# EAGLE design dummy load_moved (EAGLE 6.1)
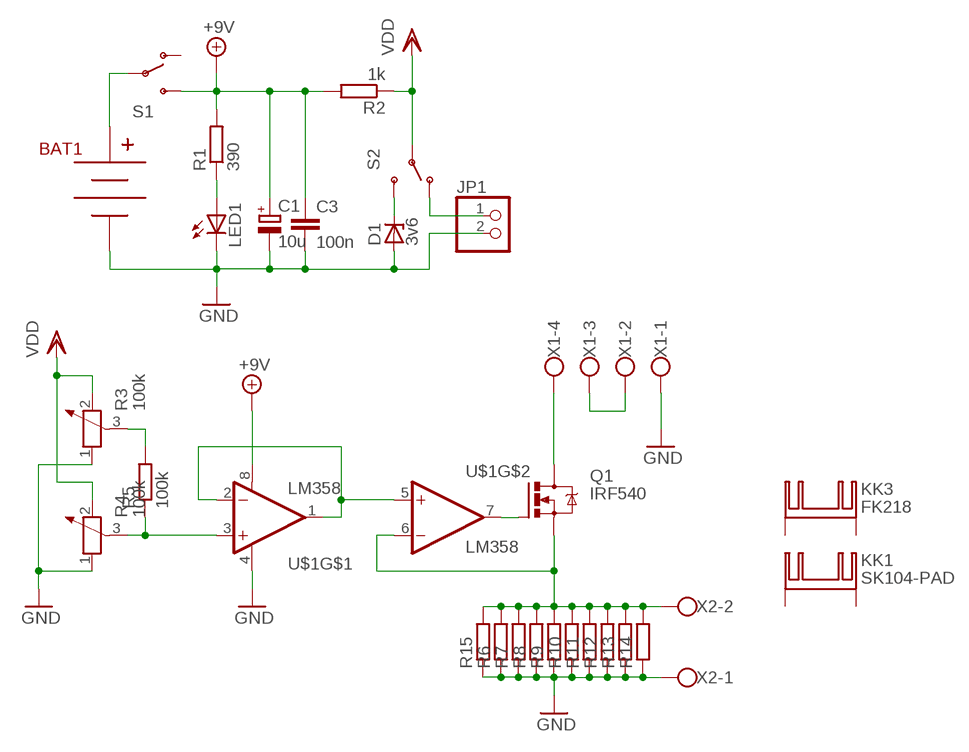
[diagram p0: schematic, sheet 1]

## Parts
BAT1  BC9VPC  [BC9VPC]
C1  10u  CPOL-EUTT2D5L  [TT2D5L]
C3  100n  C-EU025-025X050  [C025-025X050]
D1  3v6  ZENER-DIODEZD-5  [ZDIO-5]
JP1  PINHD-1X2  [1X02]
KK1  SK104-PAD  [SK104-PAD]
KK3  FK218  [FK218]
LED1  LED5MM  [LED5MM]
Q1  IRF540  [TO220BV]
R1  390  R-EU_0204/7  [0204/7]
R2  1k  R-EU_0204/7  [0204/7]
R3  100k  POTENTIOMETER_PT-10  [PT-10]
R4  100k  POTENTIOMETER_PT-10  [PT-10]
R5  100k  R-EU_0204/7  [0204/7]
R6  R-EU_0207/7  [0207/7]
R7  R-EU_0207/7  [0207/7]
R8  R-EU_0207/7  [0207/7]
R9  R-EU_0207/7  [0207/7]
R10  R-EU_0207/7  [0207/7]
R11  R-EU_0207/7  [0207/7]
R12  R-EU_0207/7  [0207/7]
R13  R-EU_0207/7  [0207/7]
R14  R-EU_0207/7  [0207/7]
R15  R-EU_0207/7  [0207/7]
S1  SWITCH-SPSTPTH  [SWITCH-SPDT]
S2  SWITCH-SPSTPTH  [SWITCH-SPDT]
U$1  LM358  [DIP08]
X1  W237-4  [W237-4]
X2  W237-102  [W237-102]

## Nets
+9V: C1.+ C3.1 R1.2 R2.2 S1.3(S) U$1.8(V+)
GND: BAT1.V- C1.- C3.2 D1.A JP1.2 LED1.K(C) R3.1 R4.1 R6.1 R7.1 R8.1 R9.1 R10.1 R11.1 R12.1 R13.1 R14.1 R15.1 U$1.4(V-) X1.1 X2.1
N$1: U$1.1(OUT) U$1.2(-IN) U$1.5(+IN)
N$2: R4.3 R5.1 U$1.3(+IN)
N$3: LED1.A R1.1
N$4: R3.3 R5.2
N$5: BAT1.V+ S1.2(P)
N$6: Q1.D X1.4
N$7: X1.2 X1.3
N$9: Q1.G U$1.7(OUT)
N$10: D1.C S2.3(S)
N$11: JP1.1 S2.1(O)
N$16: Q1.S R6.2 R7.2 R8.2 R9.2 R10.2 R11.2 R12.2 R13.2 R14.2 R15.2 U$1.6(-IN) X2.2
VDD: R2.1 R3.2 R4.2 S2.2(P)
Unconnected: KK1.K1(K) KK1.K2(K) KK3.A2,2(K) KK3.B2,2(K) S1.1(O)

## Library data of the parts
BAT1 = SparkFun-Connectors:BC9VPC: 9V board-mount battery cradle
C1 = rcl:CPOL-EU: POLARIZED CAPACITOR, European symbol
C3 = rcl:C-EU: CAPACITOR, European symbol
D1 = diode:ZENER-DIODE: Z-Diode
JP1 = pinhead:PINHD-1X2: PIN HEADER
KK1 = heatsink:SK104-PAD: HEATSINK manufacturer Fischer/distributor Buerklin
KK3 = heatsink:FK218: HEATSINK manufacturer Fischer/distributor Buerklin
LED1 = adafruit:LED: LED OSRAM: - CHIPLED LG R971, LG N971, LY N971, LG Q971, LY Q971, LO R971, LY R971 LH N974, LH R974 LS Q976, LO Q976, LY Q976 LO Q996 - Hyper CHIPLED LW Q18S LB Q993, LB Q99A, LB R99A - SideLED LS A670, LO A670, LY A670, LG A670, LP A670 LB A673, LV A673, LT A673, LW A673 LH A674 LY A675 LS A676, LA A676, LO A676, LY A676, LW A676 LS A679, LY A679, LG A679 - Hyper Micro SIDELED® LS Y876, LA Y876, LO Y876, LY Y876 LT Y87S - SmartLED LW L88C, LW L88S LB L89C, LB L89S, LG L890 LS L89K, LO L89K, LY L89K LS L896, LA L896, LO L896, LY L896 - TOPLED LS T670, LO T670, LY T670, LG T670, LP T670 LSG T670, LSP T670, LSY T670, LOP T670, LYG T670 LG T671, LOG T671, LSG T671 LB T673, LV T673, LT T673, LW T673 LH T674 LS T676, LA T676, LO T676, LY T676, LB T676, LH T676, LSB T676, LW T676 LB T67C, LV T67C, LT T67C, LS T67K, LO T67K, LY T67K, LW E67C LS E67B, LA E67B, LO E67B, LY E67B, LB E67C, LV E67C, LT E67C LW T67C LS T679, LY T679, LG T679 LS T770, LO T770, LY T770, LG T770, LP T770 LB T773, LV T773, LT T773, LW T773 LH T774 LS E675, LA E675, LY E675, LS T675 LS T776, LA T776, LO T776, LY T776, LB T776 LHGB T686 LT T68C, LB T68C - Hyper Mini TOPLED® LB M676 - Mini TOPLED Santana® LG M470 LS M47K, LO M47K, LY M47K Source: http://www.osram.convergy.de/
Q1 = transistor-power:IRF540: HEXFET Power MOSFET
R1 R2 R5-R15 = rcl:R-EU_: RESISTOR, European symbol
R3 R4 = rcl:POTENTIOMETER_: Potentiometer
S1 S2 = SparkFun:SWITCH-SPST: SPST Switch Simple slide switch. Spark Fun Electronics SKU : COM-00102
U$1 = SparkFun:LM358
X1 = con-wago-500:W237-4: WAGO SCREW CLAMP; OC_FARNELL: unknown; OC_NEWARK: unknown
X2 = con-wago-500:W237-102: WAGO SCREW CLAMP; MPN: 237-102; OC_FARNELL: unknown; OC_NEWARK: 70K9898

## Board
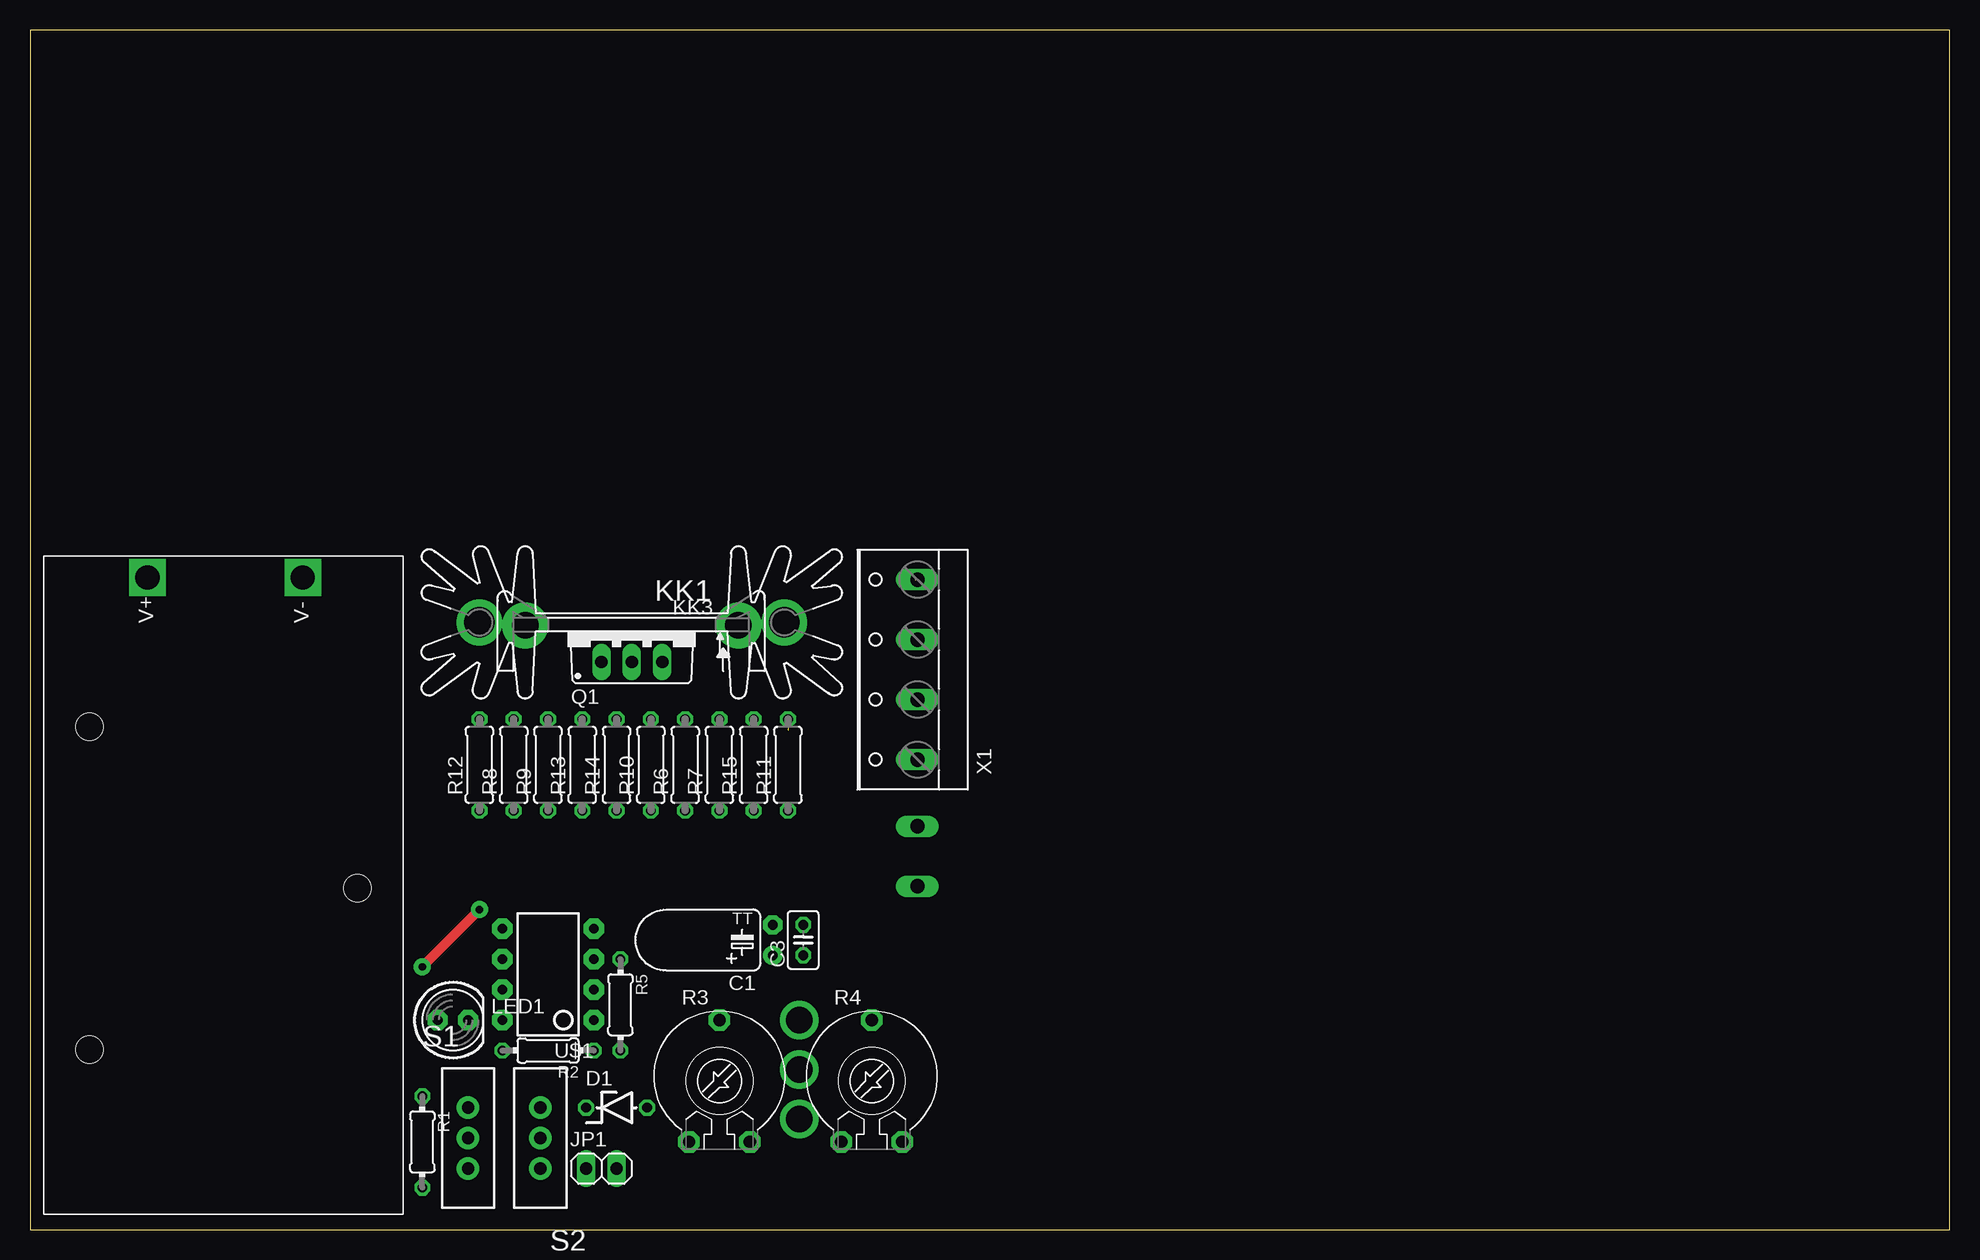
[diagram p1: board, top side]
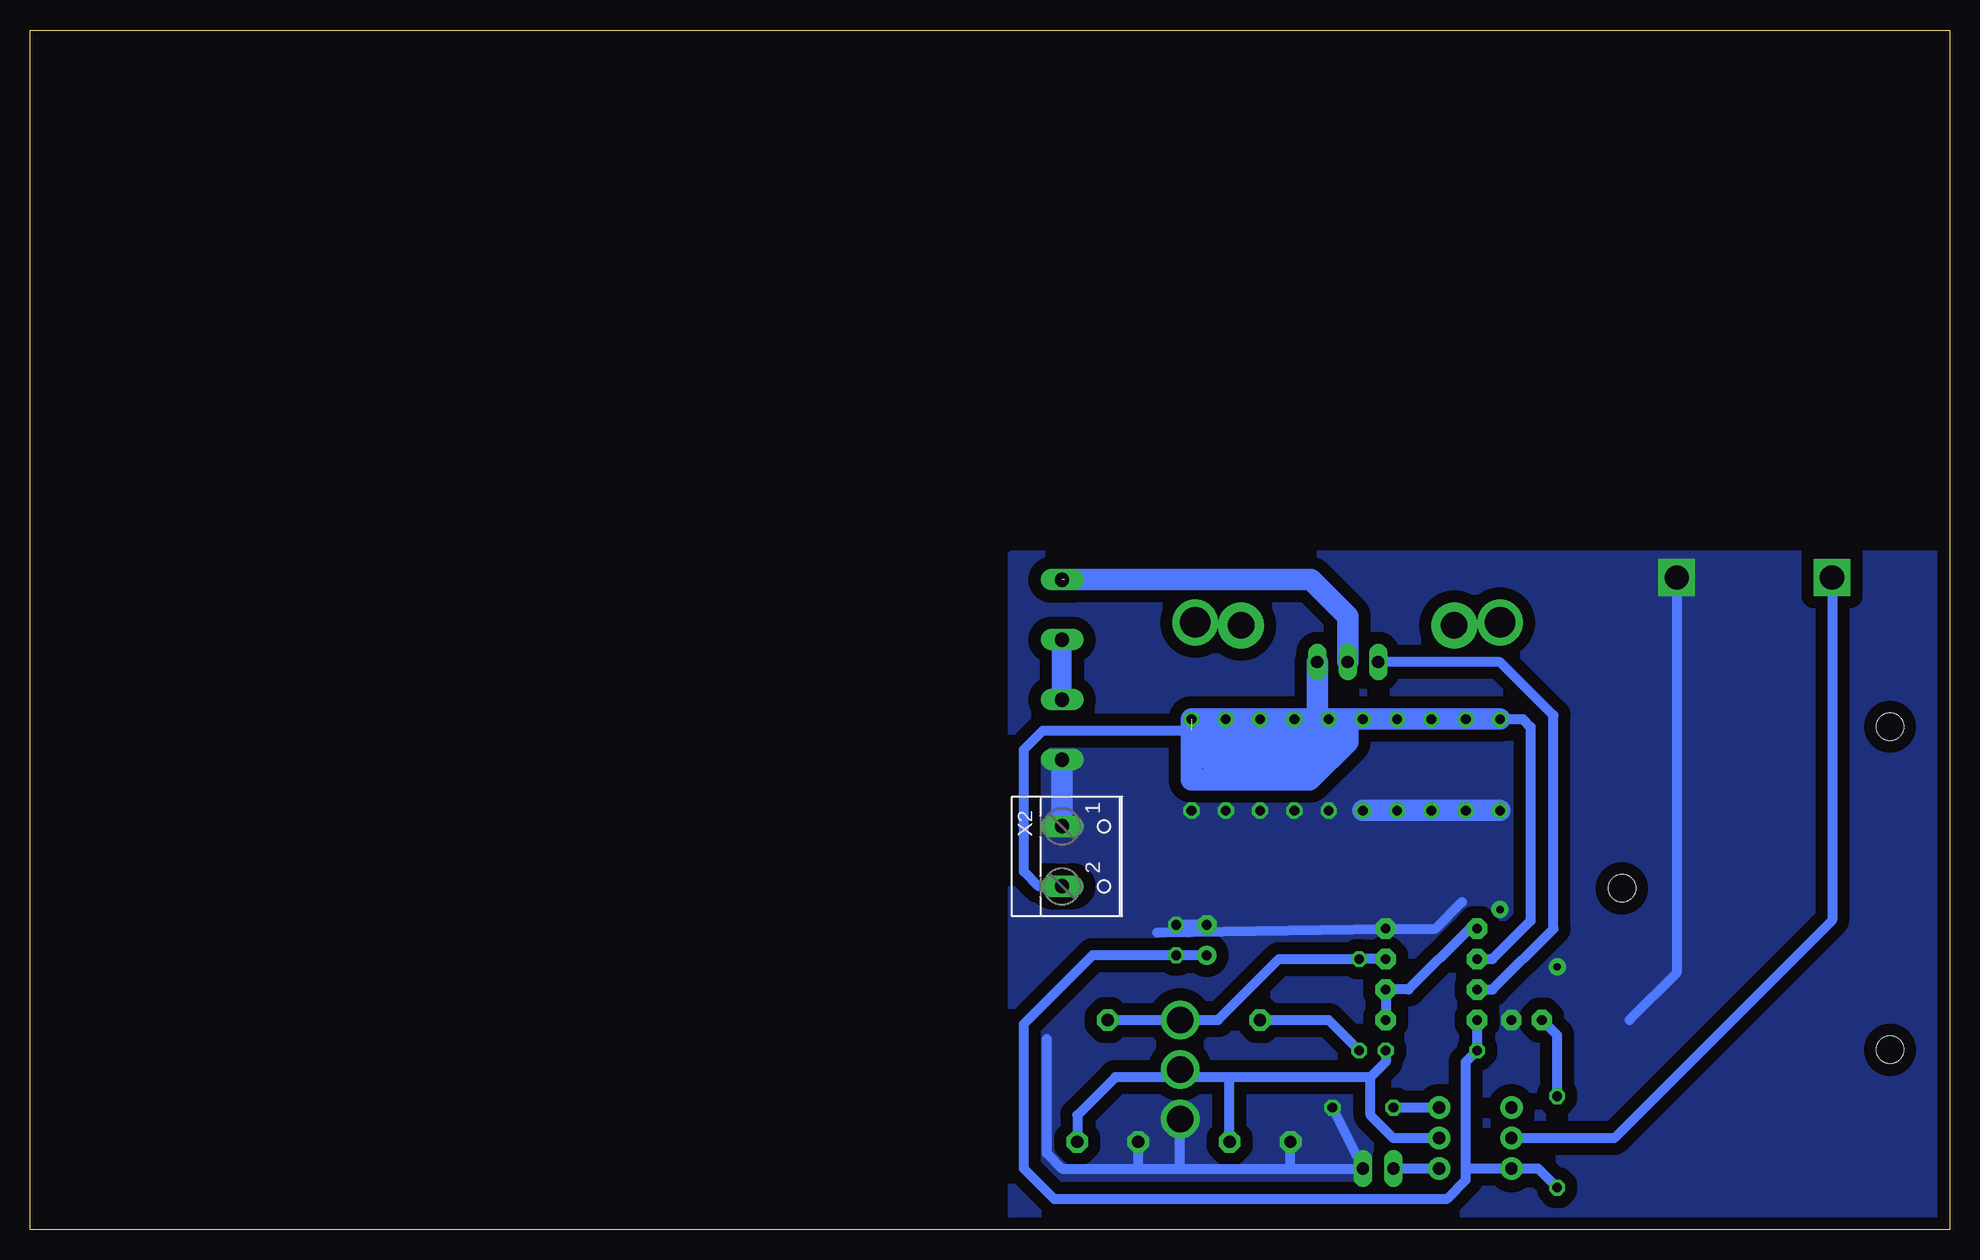
[diagram p2: board, bottom side, seen from below]

Size 160 x 100 mm. Coordinates in mm from the lower left corner, seen from the top.
Outline: 0,0 160,0 160,100 0,100 0,0
Copper layers (1*16): Top 0.035mm / dielectric 1.5mm / Bottom 0.035mm
Design rules: minimum track width 10mil, minimum drill 24mil, track to track 8mil, track to pad 8mil, pad to pad 8mil, via to via 8mil, smd to smd 8mil, copper to edge 40mil, drill to drill 8mil, minimum pad ring 10mil, minimum via ring 8mil, stop-mask expansion 4mil, vias tented up to drill 0mil, thermal gap 10mil

### Footprints (pad centres in the part's own frame; a part is rotated, then mirrored left to right if it is on the bottom)
BC9VPC = drill 2.032 square: V+ 53.086,21.336; V- 53.086,8.382 | hole 2.286: 27.178,3.81; 13.716,26.162; 40.64,26.162
TT2D5L = drill 0.813 pad 1.6: + -1.27,0 | drill 0.813 pad 1.6 octagon: - 1.27,0
C025-025X050 = drill 0.813 octagon: 1 -1.27,0; 2 1.27,0
ZDIO-5 = drill 0.813 octagon: A 2.54,0; C -2.54,0
1X02 = drill 1.016 long: 1 -1.27,0; 2 1.27,0
SK104-PAD = drill 2.54 pad 3.81: K1 -12.7,-0.762; K2 12.7,-0.762
FK218 = drill 2.21 pad 3.81: A2,2 -8.89,-0.508; B2,2 8.89,-0.508
LED5MM = drill 0.813 pad 1.676 octagon: A -1.27,0; K 1.27,0
TO220BV = drill 1.016 long: D 0,-2.54; G -2.54,-2.54; S 2.54,-2.54
0204/7 = drill 0.813 octagon: 1 -3.81,0; 2 3.81,0
PT-10 = drill 1.016 pad 1.778 octagon: 1 -2.54,-5.08; 2 2.54,-5.08; 3 0,5.08
0207/7 = drill 0.813 octagon: 1 -3.81,0; 2 3.81,0
SWITCH-SPDT = drill 1.016 pad 1.88: 1 0,2.54; 2 0,0; 3 0,-2.54
DIP08 = drill 0.813 pad 1.727 octagon: 1 -3.81,-3.81; 2 -1.27,-3.81; 3 1.27,-3.81; 4 3.81,-3.81; 5 3.81,3.81; 6 1.27,3.81; 7 -1.27,3.81; 8 -3.81,3.81
W237-4 = drill 1.194 long: 1 -7.5,-1.27; 2 -2.5,-1.27; 3 2.5,-1.27; 4 7.5,-1.27
W237-102 = drill 1.194 long: 1 -2.5,-1.27; 2 2.5,-1.27

### Placement (x,y rotation side)
BAT1  31.11,1.27 90 top
C1  61.91,24.13 90 top
C3  64.45,24.13 90 top
D1  48.9,10.16 0 top
JP1  47.62,5.08 0 top
KK1  50.16,49.85 180 top
KK3  50.16,49.85 180 top
LED1  35.24,17.46 0 top
Q1  50.16,49.85 0 top
R1  32.7,7.3 270 top
R2  43.18,14.92 180 top
R3  57.47,12.38 0 top
R4  70.17,12.38 0 top
R5  49.21,18.73 270 top
R6  54.61,38.73 90 top
R7  57.47,38.73 90 top
R8  40.32,38.73 90 top
R9  43.18,38.73 90 top
R10  51.75,38.73 90 top
R11  63.18,38.73 90 top
R12  37.47,38.73 90 top
R13  46.04,38.73 90 top
R14  48.9,38.73 90 top
R15  60.33,38.73 90 top
S1  36.51,7.62 0 top
S2  42.55,7.62 180 top
U$1  43.18,21.27 90 top
X1  72.71,46.67 90 top
X2  72.71,31.11 270 bottom

### Tracks (layer width: path | path; a pad name or v marks a point on that pad's centre or on a via)
+9V
  Bottom 0.813: 40.32,5.08 S1.3 34.29,5.08 R1.2 | 40.32,5.08 40.32,4.13 41.91,2.54 74.61,2.54 77.15,5.08 77.15,17.14 71.44,22.86 C1.+ C3.1 | U$1.8 R2.2 40.32,13.97 40.32,5.08
GND  (via drill 0.6 pad 1.42, 2.2)
  Top 0.813: v32.7,21.91 v37.47,26.67
  Bottom 0.813: BAT1.V- 22.73,21.4 26.67,17.46 | 67.63,5.08 73.98,5.08 75.25,6.35 75.25,15.88 | 67.63,5.08 64.14,5.08 | 64.14,5.08 54.93,5.08 | 54.93,5.08 JP1.2 D1.A | 54.93,5.08 R3.1 | R4.1 67.63,5.08 | 40.64,27.3 42.86,25.08 U$1.4 66.04,24.77 | C1.- C3.2 | 64.14,5.08 64.14,8.89
  Bottom 1.676: R8.1 40.96,34.92
  Bottom 1.778: R14.1 R13.1 R9.1 R8.1 R12.1 | 73.98,33.66 73.98,39.05
  other vias: 64.14,9.21
  pour Bottom (isolate 1.016, no thermals): 1.27,56.2 78.11,56.2 78.11,1.27 1.27,1.27
N$1
  Bottom 0.813: U$1.5 40.01,25.08 45.09,20 U$1.2 U$1.1
N$2  (via drill 2.2)
  Bottom 0.813: U$1.3 R5.1 55.88,22.54 60.96,17.46 v64.14,17.46 R4.3
N$3
  Bottom 0.813: R1.1 32.7,16.19 LED1.A
N$4
  Bottom 0.813: R3.3 51.75,17.46 R5.2
N$5
  Bottom 0.813: BAT1.V+ 9.78,25.78 27.94,7.62 S1.2
N$6  (1 unrouted)
  Bottom 1.778: Q1.D 50.16,51.12 53.22,54.17 73.78,54.17
N$7
  Bottom 1.676: X1.2 X1.3
N$9
  Bottom 0.813: U$1.7 38.1,20 33.02,25.08 33.02,42.86 37.47,47.31 Q1.G
N$10
  Bottom 0.813: S2.3 D1.C
N$11
  Bottom 0.813: S2.1 JP1.1
N$15
  Bottom 1.778: 50.16,42.55 50.16,40.64 53.34,37.47 63.18,37.47 63.18,42.55
N$16  (1 unrouted)
  Bottom 0.813: X2.2 75.92,28.61 77.15,29.84 77.15,40.01 75.56,41.59 63.18,41.59 | U$1.6 38.1,22.54 34.92,25.72 34.92,41.91 35.56,42.55 R12.2
  Bottom 1.676: 52.7,42.55 R6.2 R7.2 | R12.2 R8.2 R9.2 R13.2 R14.2 51.44,42.55 | 57.78,42.55 R15.2 R11.2
  Bottom 1.778: Q1.S 52.7,42.55 | R11.2 57.78,42.55 R7.2 52.7,42.55 | R12.2 51.44,42.55 R10.2 52.7,42.55
N$17
  Bottom 1.778: 51.75,41.27 51.75,40.96 53.66,39.05 61.59,39.05 61.59,41.27 53.34,41.27 54.29,40.32 60.64,40.32
VDD  (via drill 2.2)
  Bottom 0.813: R4.2 72.71,9.53 69.53,12.7 64.14,12.7 | 48.26,12.7 60.01,12.7 | 60.01,12.7 64.14,12.7 | R3.2 60.01,12.7 | S2.2 46.35,7.62 48.26,9.53 48.26,12.7 | v64.14,13.34 64.14,12.7 | R2.1 46.99,13.97 48.26,12.7
(copper drawn outside any net)
  shapes: Top area x1